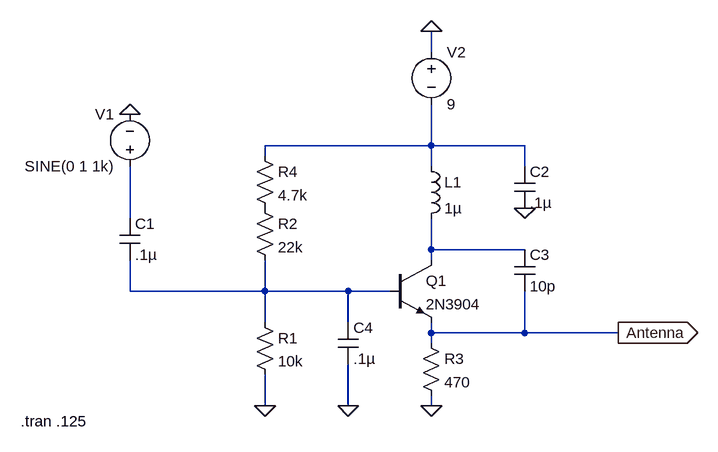
[diagram p0: schematic EE430_Project1V3.asc]
EE430_Project1V3.asc, the LTspice schematic file:
Version 4
SHEET 1 972 680
WIRE 528 -128 528 -160
WIRE 528 16 528 -48
WIRE 528 16 272 16
WIRE 672 16 528 16
WIRE 272 32 272 16
WIRE 528 48 528 16
WIRE 672 48 672 16
WIRE 64 128 64 48
WIRE 528 176 528 128
WIRE 672 176 528 176
WIRE 528 192 528 176
WIRE 64 240 64 192
WIRE 272 240 272 192
WIRE 272 240 64 240
WIRE 400 240 272 240
WIRE 464 240 400 240
WIRE 272 288 272 240
WIRE 400 288 400 240
WIRE 528 304 528 288
WIRE 672 304 672 240
WIRE 672 304 528 304
WIRE 816 304 672 304
WIRE 528 320 528 304
WIRE 272 416 272 368
WIRE 400 416 400 352
WIRE 528 416 528 400
FLAG 64 -32 0
FLAG 272 416 0
FLAG 672 112 0
FLAG 528 416 0
FLAG 816 304 Antenna
IOPIN 816 304 Out
FLAG 528 -160 0
FLAG 400 416 0
SYMBOL cap 48 128 R0
SYMATTR InstName C1
SYMATTR Value .1µ
SYMBOL voltage 64 64 R180
WINDOW 0 24 96 Left 2
WINDOW 3 24 16 Left 2
WINDOW 123 0 0 Left 0
WINDOW 39 0 0 Left 0
SYMATTR InstName V1
SYMATTR Value SINE(0 1 1k)
SYMBOL npn 464 192 R0
SYMATTR InstName Q1
SYMATTR Value 2N3904
SYMBOL res 256 272 R0
SYMATTR InstName R1
SYMATTR Value 10k
SYMBOL res 256 96 R0
SYMATTR InstName R2
SYMATTR Value 22k
SYMBOL cap 656 48 R0
SYMATTR InstName C2
SYMATTR Value .1µ
SYMBOL ind 512 32 R0
SYMATTR InstName L1
SYMATTR Value 1µ
SYMBOL res 512 304 R0
SYMATTR InstName R3
SYMATTR Value 470
SYMBOL cap 656 176 R0
SYMATTR InstName C3
SYMATTR Value 10p
SYMBOL voltage 528 -144 R0
WINDOW 123 0 0 Left 0
WINDOW 39 0 0 Left 0
SYMATTR InstName V2
SYMATTR Value 9
SYMBOL res 256 16 R0
SYMATTR InstName R4
SYMATTR Value 4.7k
SYMBOL cap 384 288 R0
SYMATTR InstName C4
SYMATTR Value .1µ
TEXT -104 440 Left 2 !.tran .125

The netlist it stands for:
* EE430_Project1V3.asc
C1 N002 N004 .1µ
V1 N002 0 SINE(0 1 1k)
Q1 N003 N004 Antenna 0 2N3904
R1 N004 0 10k
R2 P001 N004 22k
C2 N001 0 .1µ
L1 N001 N003 1µ
R3 Antenna 0 470
C3 N003 Antenna 10p
V2 0 N001 9
R4 N001 P001 4.7k
C4 N004 0 .1µ
.model NPN NPN
.model PNP PNP
.lib standard.bjt
.tran .125
.backanno
.end